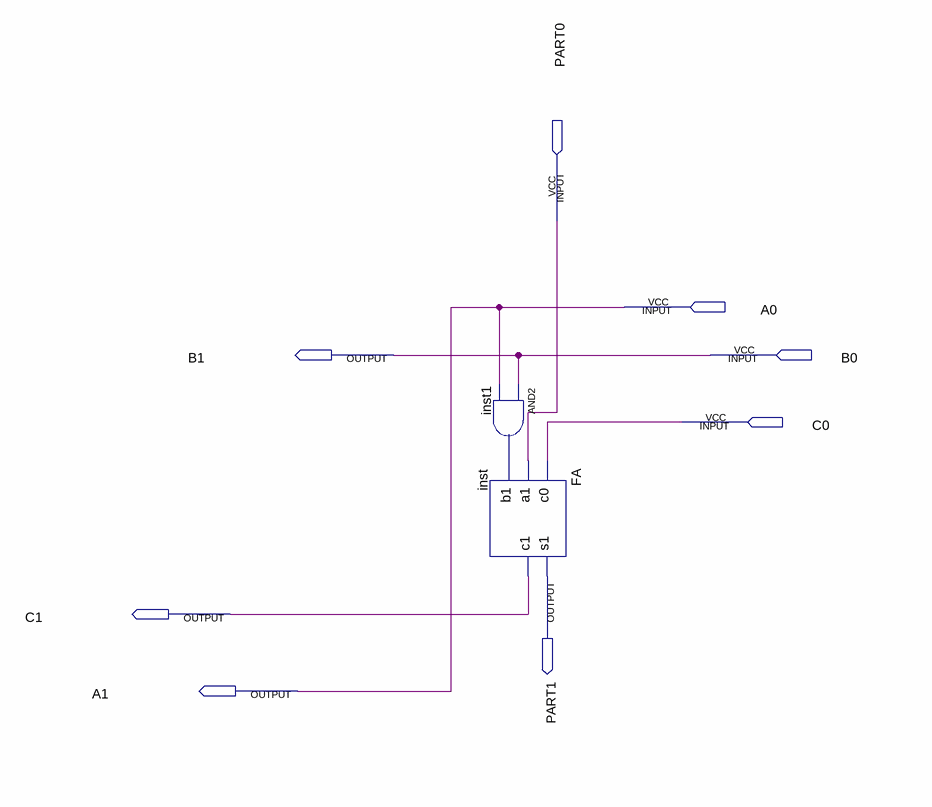
[diagram p0: schematic sheet]
// Quartus schematic cell.bdf as structural Verilog: 2 symbols, 8 pins
module \cell  (
  input  PART0,
  input  A0,
  input  B0,
  input  C0,
  output B1,
  output PART1,
  output C1,
  output A1
);

  wire inst1_out;

  and inst1 (inst1_out, B0, A0);
  FA inst (.c0(C0), .a1(PART0), .b1(inst1_out), .s1(PART1), .c1(C1));

  assign A1 = A0;
  assign B1 = B0;
endmodule
